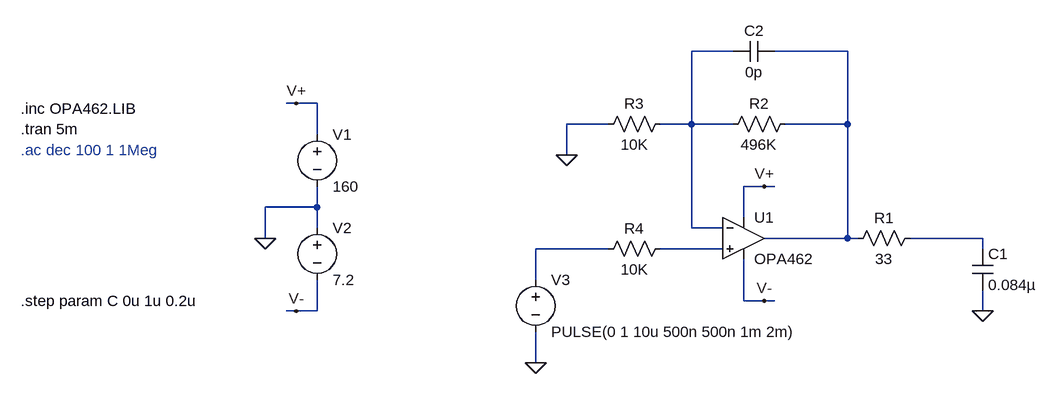
[diagram p0: schematic PZT_Driver.asc]
PZT_Driver.asc, the LTspice schematic file:
Version 4.1
SHEET 1 880 680
WIRE -32 -208 -96 -208
WIRE 144 -208 32 -208
WIRE -704 -128 -720 -128
WIRE -672 -128 -704 -128
WIRE -224 -96 -288 -96
WIRE -96 -96 -96 -208
WIRE -96 -96 -144 -96
WIRE -32 -96 -96 -96
WIRE 144 -96 144 -208
WIRE 144 -96 48 -96
WIRE -672 -80 -672 -128
WIRE -288 -48 -288 -96
WIRE 16 0 -16 0
WIRE 32 0 16 0
WIRE -672 32 -672 0
WIRE -672 32 -752 32
WIRE -16 48 -16 0
WIRE -672 64 -672 32
WIRE -96 64 -96 -96
WIRE -48 64 -96 64
WIRE -752 80 -752 32
WIRE 144 80 144 -96
WIRE 144 80 16 80
WIRE 160 80 144 80
WIRE 352 80 240 80
WIRE -224 96 -336 96
WIRE -48 96 -144 96
WIRE 352 96 352 80
WIRE -336 144 -336 96
WIRE -16 176 -16 112
WIRE 16 176 -16 176
WIRE 32 176 16 176
WIRE -704 192 -720 192
WIRE -672 192 -672 144
WIRE -672 192 -704 192
WIRE 352 192 352 160
WIRE -336 272 -336 224
FLAG -752 80 0
FLAG -704 -128 V+
FLAG -704 192 V-
FLAG 16 0 V+
FLAG 16 176 V-
FLAG 352 192 0
FLAG -288 -48 0
FLAG -336 272 0
SYMBOL OpAmps\\opamp2 -16 16 R0
SYMATTR InstName U1
SYMATTR Value OPA462
SYMBOL voltage -672 48 R0
WINDOW 123 0 0 Left 0
WINDOW 39 0 0 Left 0
SYMATTR InstName V2
SYMATTR Value 7.2
SYMBOL voltage -672 -96 R0
WINDOW 123 0 0 Left 0
WINDOW 39 0 0 Left 0
SYMATTR InstName V1
SYMATTR Value 160
SYMBOL res 256 64 R90
WINDOW 0 0 56 VBottom 2
WINDOW 3 32 56 VTop 2
SYMATTR InstName R1
SYMATTR Value 33
SYMBOL res 64 -112 R90
WINDOW 0 0 56 VBottom 2
WINDOW 3 32 56 VTop 2
SYMATTR InstName R2
SYMATTR Value 496K
SYMBOL res -128 -112 R90
WINDOW 0 0 56 VBottom 2
WINDOW 3 32 56 VTop 2
SYMATTR InstName R3
SYMATTR Value 10K
SYMBOL res -128 80 R90
WINDOW 0 0 56 VBottom 2
WINDOW 3 32 56 VTop 2
SYMATTR InstName R4
SYMATTR Value 10K
SYMBOL voltage -336 128 R0
WINDOW 39 0 0 Left 0
SYMATTR InstName V3
SYMATTR Value PULSE(0 1 10u 500n 500n 1m 2m)
SYMATTR Value2 AC 0.5
SYMBOL cap 32 -224 R90
WINDOW 0 0 32 VBottom 2
WINDOW 3 32 32 VTop 2
SYMATTR InstName C2
SYMATTR Value 0p
SYMBOL cap 336 96 R0
SYMATTR InstName C1
SYMATTR Value 0.084µ
TEXT -1128 -120 Left 2 !.inc OPA462.LIB
TEXT -1128 -88 Left 2 !.tran 5m
TEXT -1128 -56 Left 2 ;.ac dec 100 1 1Meg
TEXT -1128 176 Left 2 !.step param C 0u 1u 0.2u

The netlist it stands for:
* PZT_Driver.asc
X§U1 N005 N001 V+ V- N002 OPA462  ; pins In+ In- V+ V- OUT
V2 0 V- 7.2
V1 V+ 0 160
R1 N003 N002 33
R2 N002 N001 496K
R3 N001 0 10K
R4 N005 N004 10K
V3 N004 0 PULSE(0 1 10u 500n 500n 1m 2m) AC 0.5
C2 N002 N001 0p
C1 N003 0 0.084µ
.inc OPA462.LIB
.tran 5m
* .ac dec 100 1 1Meg
.step param C 0u 1u 0.2u
.backanno
.end